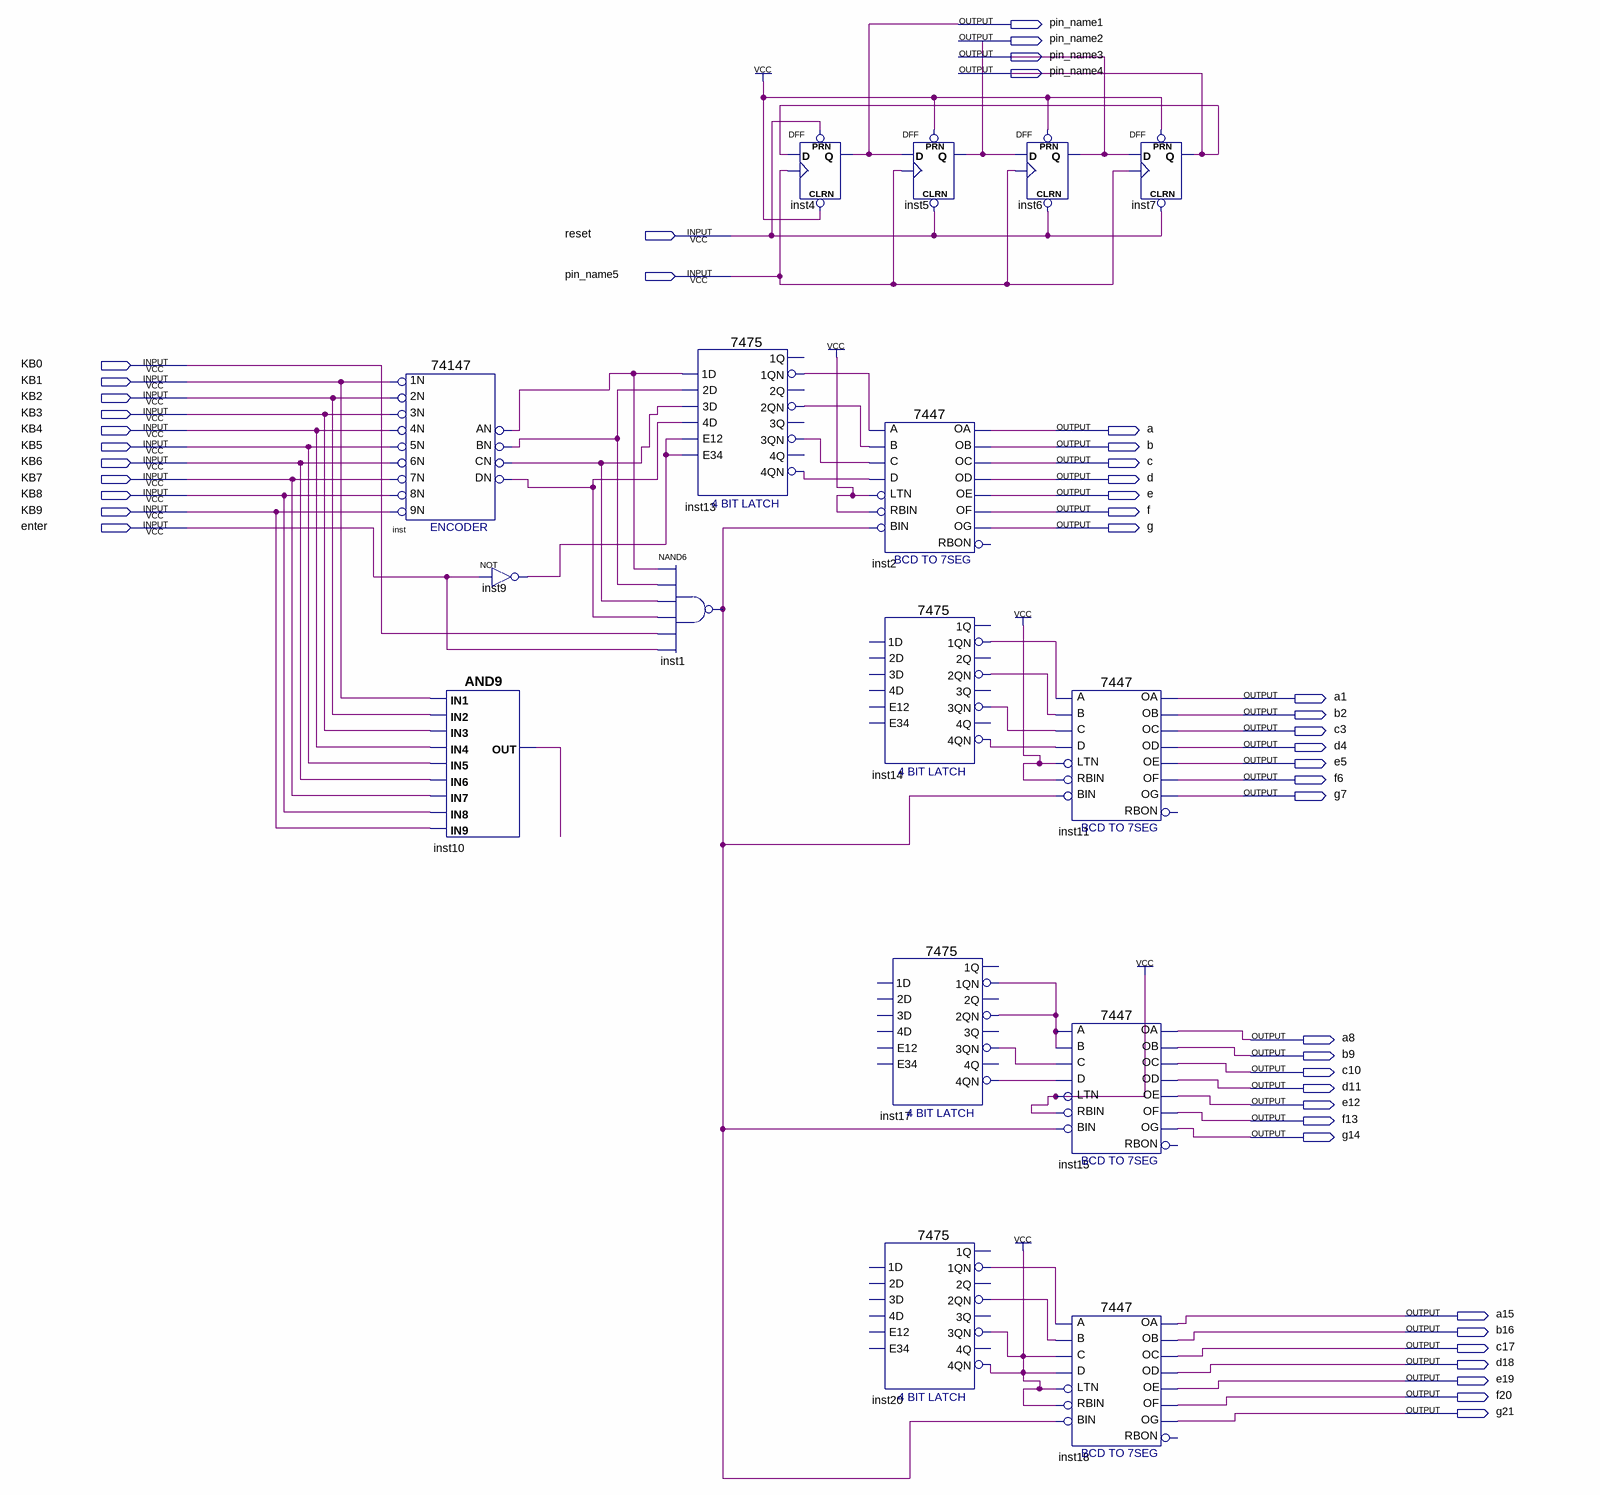
[diagram p0: schematic sheet]
// Quartus schematic circuitosSecuritybox2.1.bdf as structural Verilog: 16 symbols, 45 pins
module \circuitosSecuritybox2.1  (
  input  reset,
  input  pin_name5,
  input  KB0,
  input  KB1,
  input  KB2,
  input  KB3,
  input  KB4,
  input  KB5,
  input  KB6,
  input  KB7,
  input  KB8,
  input  KB9,
  input  enter,
  output pin_name1,
  output pin_name2,
  output pin_name3,
  output pin_name4,
  output a,
  output b,
  output c,
  output d,
  output e,
  output f,
  output g,
  output a1,
  output b2,
  output c3,
  output d4,
  output e5,
  output f6,
  output g7,
  output a8,
  output b9,
  output c10,
  output d11,
  output e12,
  output f13,
  output g14,
  output a15,
  output b16,
  output c17,
  output d18,
  output e19,
  output f20,
  output g21
);

  wire inst1_out, inst9_out, inst10_out, inst13_1qn, inst13_2qn, inst13_3qn, inst13_4qn, inst14_1qn,
       inst14_2qn, inst14_3qn, inst14_4qn, inst17_1qn, inst17_3qn, inst17_4qn, inst20_1qn, inst20_2qn,
       inst20_3qn, inst_an, inst_bn, inst_cn, inst_dn;

  \74147  inst (
    .\1N (KB1), .\2N (KB2), .\3N (KB3), .\6N (KB6), .\5N (KB5), .\4N (KB4), .\9N (KB9), .\8N (KB8),
    .\7N (KB7), .CN(inst_cn), .BN(inst_bn), .AN(inst_an), .DN(inst_dn));
  and inst10 (inst10_out, KB1, KB2, KB3, KB4, KB5, KB6, KB7, KB8, KB9);
  not inst9 (inst9_out, enter);
  \7475  inst13 (
    .E12(inst9_out), .\3D (inst_cn), .\4D (inst_dn), .\2D (inst_bn), .E34(inst9_out), .\1D (inst_an),
    .\1QN (inst13_1qn), .\3QN (inst13_3qn), .\4QN (inst13_4qn), .\2QN (inst13_2qn));  // open: 1Q, 2Q, 3Q, 4Q
  nand inst1 (inst1_out, inst_an, inst_bn, inst_cn, inst_dn, KB0, enter);
  DFF inst4 (.CLRN(1'b1), .CLK(pin_name5), .D(pin_name4), .PRN(reset), .Q(pin_name1));
  DFF inst5 (.CLRN(reset), .CLK(pin_name5), .D(pin_name1), .PRN(1'b1), .Q(pin_name2));
  \7447  inst2 (
    .LTN(1'b1), .B(inst13_2qn), .C(inst13_3qn), .D(inst13_4qn), .RBIN(1'b1), .BIN(inst1_out), .A(inst13_1qn),
    .OB(b), .OC(c), .OE(e), .OD(d), .OF(f), .OG(g), .OA(a));  // open: RBON
  \7475  inst14 (
    .\1QN (inst14_1qn), .\3QN (inst14_3qn), .\4QN (inst14_4qn), .\2QN (inst14_2qn));  // open: E12, 3D, 4D, 2D, E34, 1D, 1Q, 2Q, 3Q, 4Q
  \7475  inst17 (
    .\1QN (inst17_1qn), .\3QN (inst17_3qn), .\4QN (inst17_4qn), .\2QN (inst17_1qn));  // open: E12, 3D, 4D, 2D, E34, 1D, 1Q, 2Q, 3Q, 4Q
  \7475  inst20 (
    .\1QN (inst20_1qn), .\3QN (inst20_3qn), .\4QN (inst20_3qn), .\2QN (inst20_2qn));  // open: E12, 3D, 4D, 2D, E34, 1D, 1Q, 2Q, 3Q, 4Q
  DFF inst6 (.CLRN(reset), .CLK(pin_name5), .D(pin_name2), .PRN(1'b1), .Q(pin_name3));
  \7447  inst11 (
    .LTN(1'b1), .B(inst14_2qn), .C(inst14_3qn), .D(inst14_4qn), .RBIN(1'b1), .BIN(inst1_out), .A(inst14_1qn),
    .OB(b2), .OC(c3), .OE(e5), .OD(d4), .OF(f6), .OG(g7), .OA(a1));  // open: RBON
  \7447  inst15 (
    .LTN(1'b1), .B(inst17_1qn), .C(inst17_3qn), .D(inst17_4qn), .RBIN(1'b1), .BIN(inst1_out), .A(inst17_1qn),
    .OB(b9), .OC(c10), .OE(e12), .OD(d11), .OF(f13), .OG(g14), .OA(a8));  // open: RBON
  \7447  inst18 (
    .LTN(inst20_3qn), .B(inst20_2qn), .C(inst20_3qn), .D(inst20_3qn), .RBIN(inst20_3qn), .BIN(inst1_out),
    .A(inst20_1qn), .OB(b16), .OC(c17), .OE(e19), .OD(d18), .OF(f20), .OG(g21), .OA(a15));  // open: RBON
  DFF inst7 (.CLRN(reset), .CLK(pin_name5), .D(pin_name3), .PRN(1'b1), .Q(pin_name4));
  // also tied to VCC on the sheet: inst20_3qn
endmodule
